# Altium schematic sheet io.SchDoc
size Tabloid
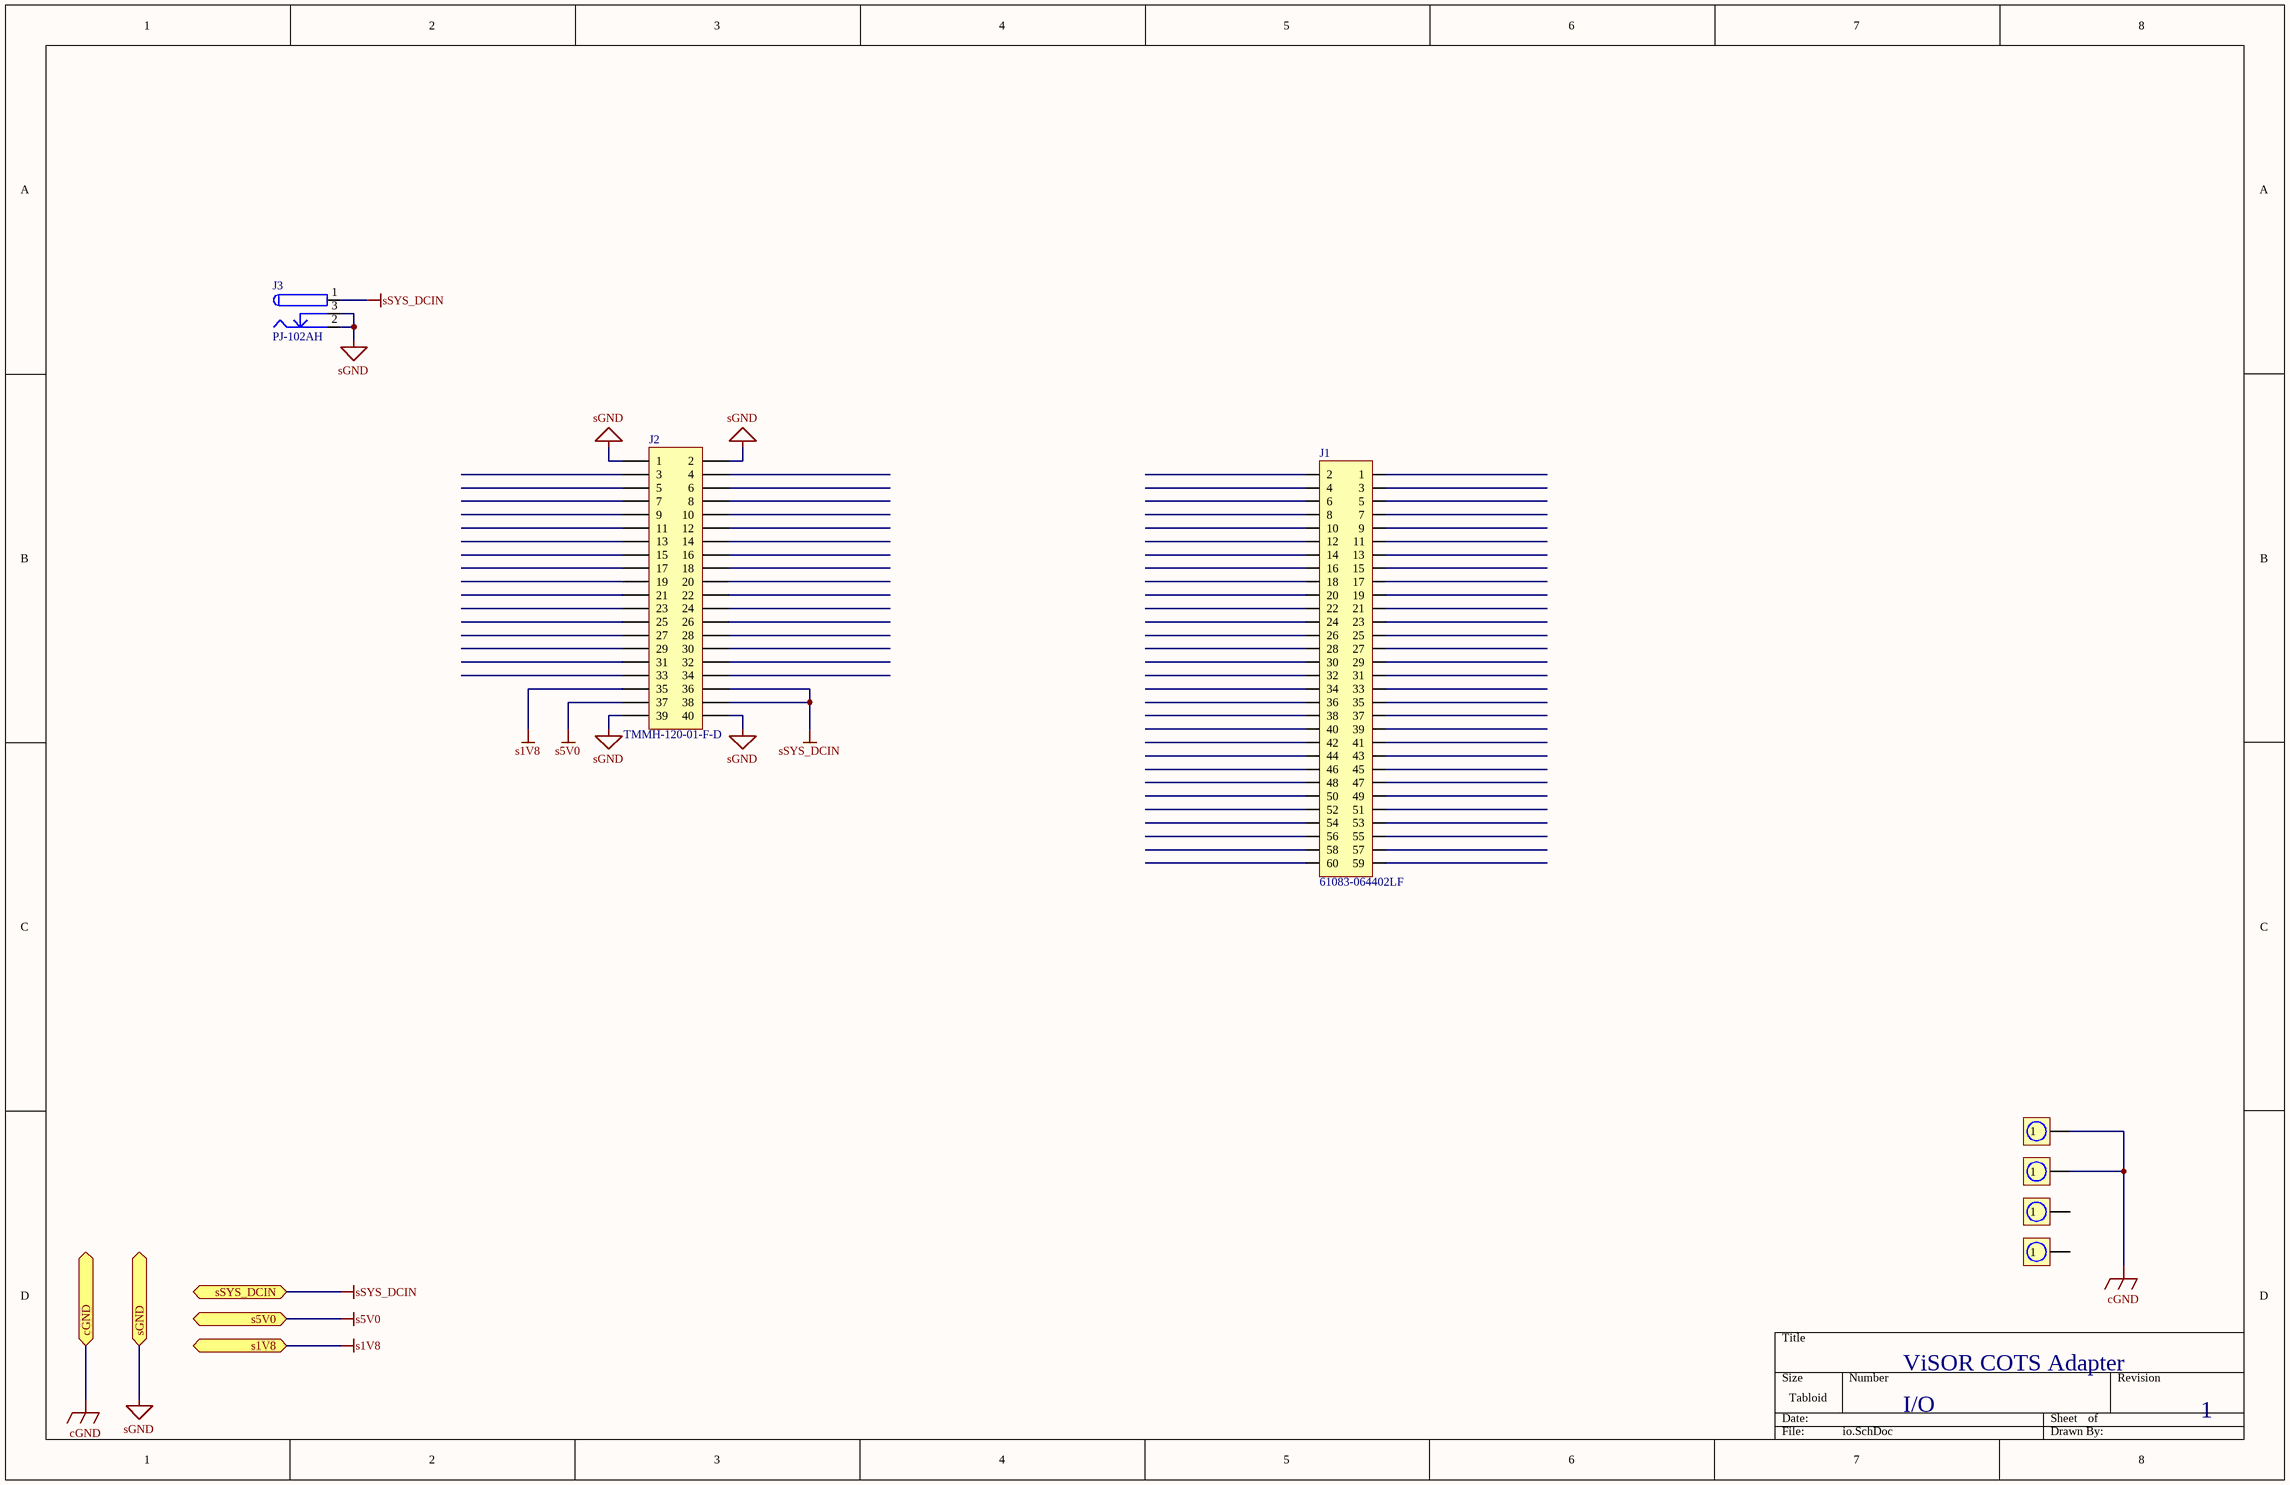
[diagram p0: io.SchDoc]

## Parts
J1  61083-064402LF  [61083-064402LF]
J2  TMMH-120-01-F-D  [HDR2X20.Metric]
J3  PJ-102AH  [PJ-102AH]
M1  Mount  [MOUNT_PLATED-M2.5]  (value not drawn)
M2  Mount  [MOUNT_PLATED-M2.5]  (value not drawn)
M3  Mount  [MOUNT_UNPLATED-M2.5]  (value not drawn)
M4  Mount  [MOUNT_UNPLATED-M2.5]  (value not drawn)

## Ports
cGND, s1V8, s5V0, sGND, sSYS_DCIN

## Nets
cGND: M1.1 M2.1 ; port cGND
s1V8: J2.35 ; port s1V8
s5V0: J2.37 ; port s5V0
sGND: J2.1 J2.2 J2.39 J2.40 J3.2 J3.3 ; port sGND
sSYS_DCIN: J2.36 J2.38 J3.1 ; port sSYS_DCIN

Not connected (* = marked no-connect by the designer): J1 1 2 3 4 5 6 7 8 9 10 11 12 13 14 15 16 17 18 19 20 21 22 23 24 25 26 27 28 29 30 31 32 33 34 35 36 37 38 39 40 41 42 43 44 45 46 47 48 49 50 51 52 53 54 55 56 57 58 59 60; J2 3 4 5 6 7 8 9 10 11 12 13 14 15 16 17 18 19 20 21 22 23 24 25 26 27 28 29 30 31 32 33 34; M3 1; M4 1

## Notes on the sheet
- ViSOR COTS Adapter
- I/O
- 1

## Library data of the parts
J2 = TMMH-120-01-F-D: Header, 2x20-Pin, Dual row, Metric
J3 = PJ-102AH: Low Voltage Power Supply Connector, 2.1 mm; Supplier 1: Mouser; Supplier Part Number 1: 490-PJ-102AH
M1-M4 = Mount-M2.5: Mounting Point for M2.5 Screw
J1 = 61083-064402LF: Supplier 1: Mouser; Supplier Part Number 1: 649-61083-064402LF